# EAGLE design Interface_Board (EAGLE 9.0.1)
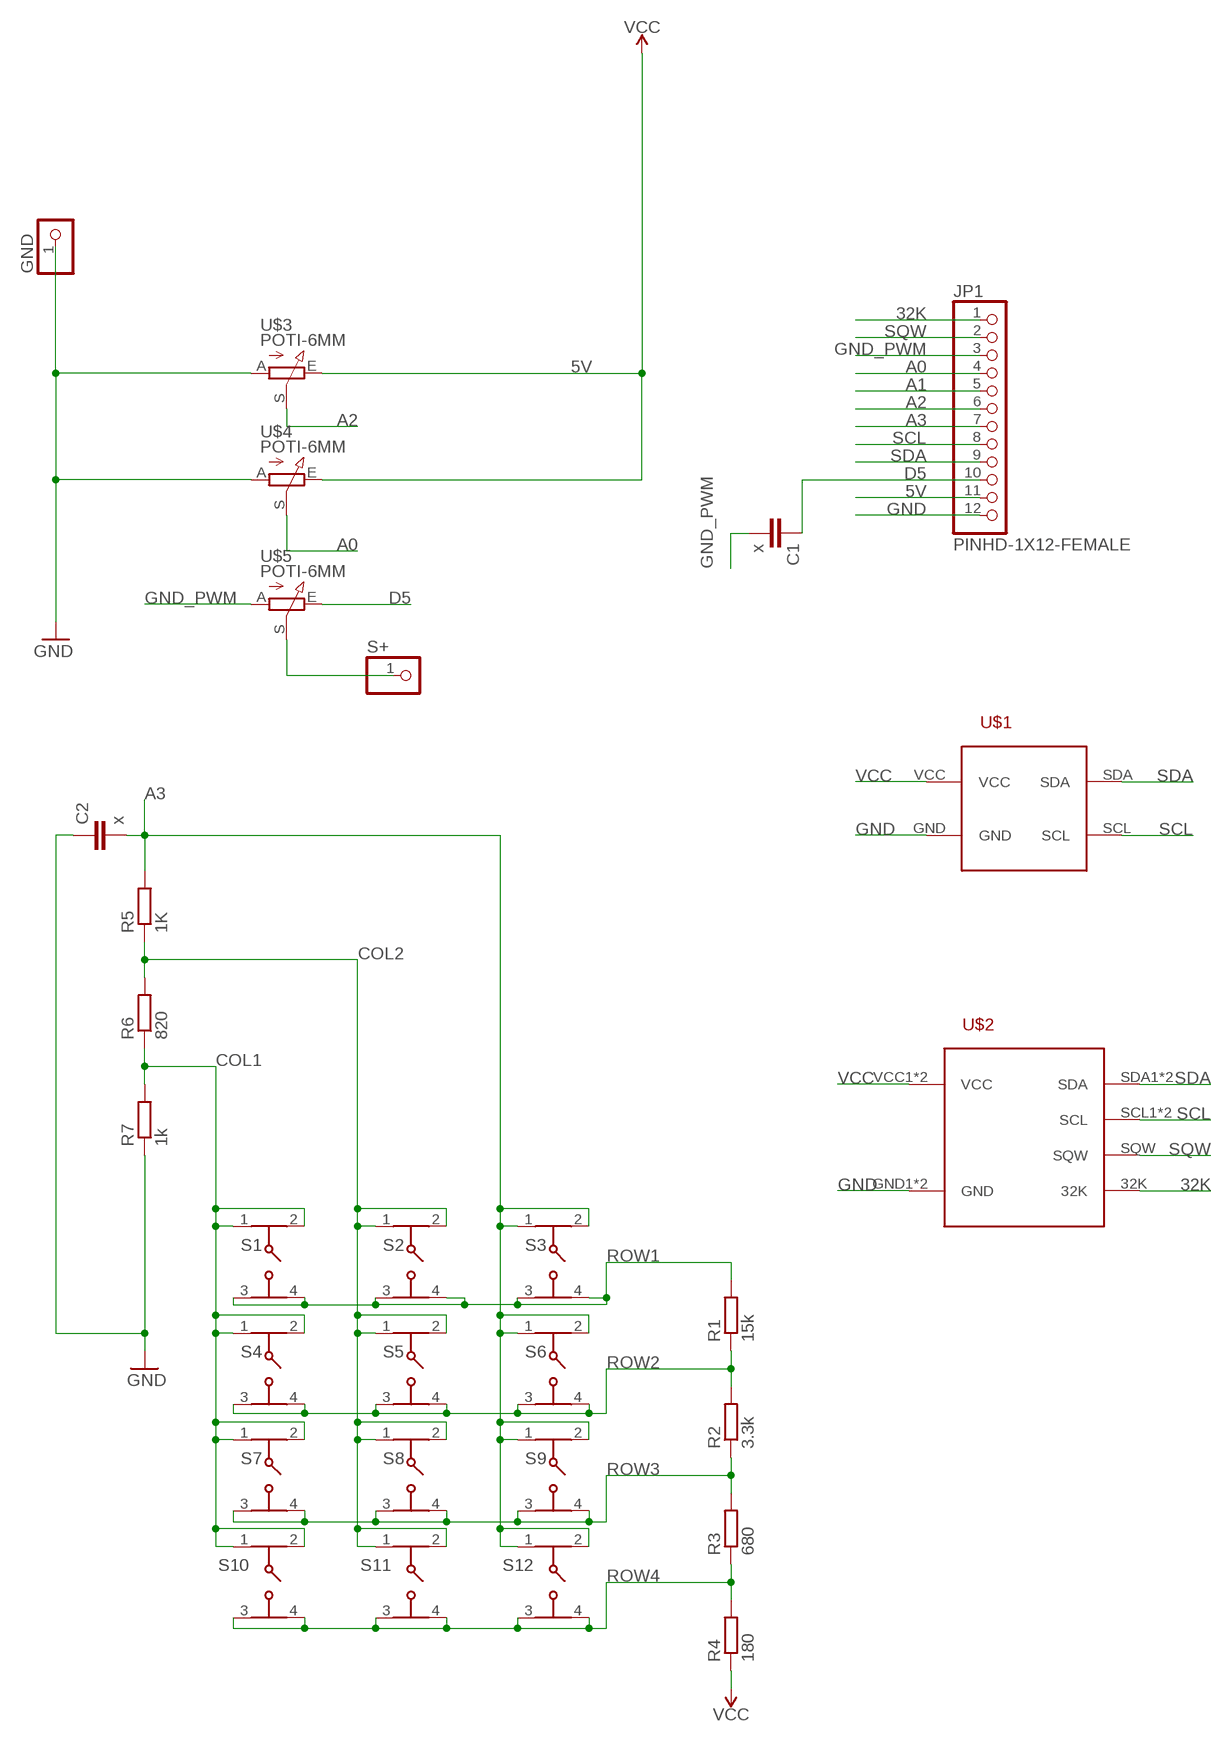
[diagram p0: schematic, sheet 1]

## Parts
C1  x  C-EU025-025X050  [C025-025X050]
C2  x  C-EU025-025X050  [C025-025X050]
GND  PINHD-1X1  [1X01]
JP1  PINHD-1X12-FEMALE  [1X12-FEMALE]
R1  15k  R-EU_R0603  [R0603]
R2  3.3k  R-EU_R0603  [R0603]
R3  680  R-EU_R0603  [R0603]
R4  180  R-EU_R0603  [R0603]
R5  1K  R-EU_R0603  [R0603]
R6  820  R-EU_R0603  [R0603]
R7  1k  R-EU_R0603  [R0603]
S1  TACTILE_BUTTON_6X6X9.5  [TACTILE_SWITCH_PTH_6.0MM]
S2  TACTILE_BUTTON_6X6X9.5  [TACTILE_SWITCH_PTH_6.0MM]
S3  TACTILE_BUTTON_6X6X9.5  [TACTILE_SWITCH_PTH_6.0MM]
S4  TACTILE_BUTTON_6X6X9.5  [TACTILE_SWITCH_PTH_6.0MM]
S5  TACTILE_BUTTON_6X6X9.5  [TACTILE_SWITCH_PTH_6.0MM]
S6  TACTILE_BUTTON_6X6X9.5  [TACTILE_SWITCH_PTH_6.0MM]
S7  TACTILE_BUTTON_6X6X9.5  [TACTILE_SWITCH_PTH_6.0MM]
S8  TACTILE_BUTTON_6X6X9.5  [TACTILE_SWITCH_PTH_6.0MM]
S9  TACTILE_BUTTON_6X6X9.5  [TACTILE_SWITCH_PTH_6.0MM]
S10  TACTILE_BUTTON_6X6X9.5  [TACTILE_SWITCH_PTH_6.0MM]
S11  TACTILE_BUTTON_6X6X9.5  [TACTILE_SWITCH_PTH_6.0MM]
S12  TACTILE_BUTTON_6X6X9.5  [TACTILE_SWITCH_PTH_6.0MM]
S+  PINHD-1X1  [1X01]
U$1  OLED_BREAKOUT  [OLED_128X32_BREAKOUT]
U$2  DS3231_BREAKOUT  [DS3231_BREAKOUT]
U$3  POTI-6MM  [POTI-6MM]
U$4  POTI-6MM  [POTI-6MM]
U$5  POTI-6MM  [POTI-6MM]

## Nets
5V: JP1.11 U$3.E U$4.E ; supply symbol labelled VCC
32K [Signal]: JP1.1 U$2.32K
A0 [Signal]: JP1.4 U$4.S
A1 [Signal]: JP1.5
A2 [Signal]: JP1.6 U$3.S
A3: C2.2 JP1.7 R5.2 S3.1 S3.2 S6.1 S6.2 S9.1 S9.2 S12.1 S12.2
COL1: R6.1 R7.2 S1.1 S1.2 S4.1 S4.2 S7.1 S7.2 S10.1 S10.2
COL2: R5.1 R6.2 S2.1 S2.2 S5.1 S5.2 S8.1 S8.2 S11.1 S11.2
D5: C1.1 JP1.10 U$5.E
GND: C2.1 GND.1 JP1.12 R7.1 U$1.GND U$2.GND1(GND) U$2.GND2(GND) U$3.A U$4.A
GND_PWM [Signal]: C1.2 JP1.3 U$5.A
ROW1: R1.2 S1.3 S1.4 S2.3 S2.4 S3.3 S3.4
ROW2: R1.1 R2.2 S4.3 S4.4 S5.3 S5.4 S6.3 S6.4
ROW3: R2.1 R3.2 S7.3 S7.4 S8.3 S8.4 S9.3 S9.4
ROW4: R3.1 R4.2 S10.3 S10.4 S11.3 S11.4 S12.3 S12.4
S+ [Signal]: S+.1 U$5.S
SCL [Signal]: JP1.8 U$1.SCL U$2.SCL1(SCL) U$2.SCL2(SCL)
SDA [Signal]: JP1.9 U$1.SDA U$2.SDA1(SDA) U$2.SDA2(SDA)
SQW [Signal]: JP1.2 U$2.SQW
VCC: R4.1 U$1.VCC U$2.VCC1(VCC) U$2.VCC2(VCC)

## Library data of the parts
C1 C2 = rcl:C-EU: CAPACITOR, European symbol; SPICEPREFIX: C
GND S+ = pinhead:PINHD-1X1: PIN HEADER
JP1 = Pat Sonstiges:PINHD-1X12
R1-R7 = rcl:R-EU_: RESISTOR, European symbol; SPICEPREFIX: R
S1-S12 = Pat Sonstiges:TACTILE_BUTTON_6X6X9.5
U$1 = My Breakout Boards:OLED_BREAKOUT
U$2 = My Breakout Boards:DS3231_BREAKOUT
U$3-U$5 = Pat Sonstiges:POTI-

## Net classes
0 GND/VCC: width 0.254 mm, drill 0.8 mm, clearance 0.254 mm
1 Signal: width 0.254 mm, drill 0.8 mm, clearance 0.254 mm to class 0, clearance 0.254 mm

## Board
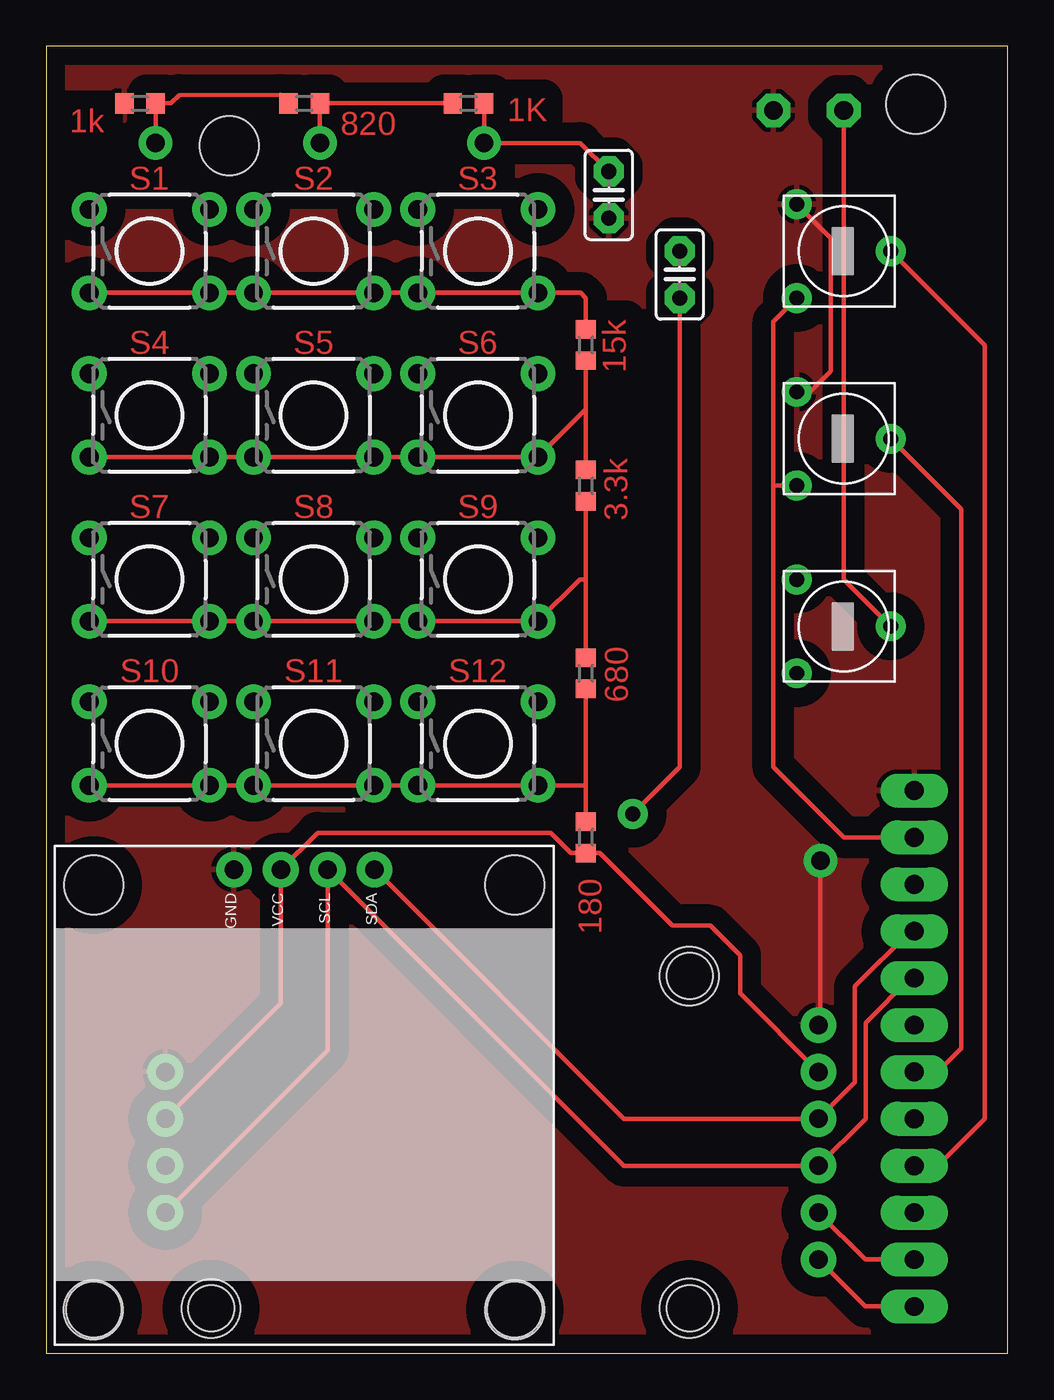
[diagram p1: board, top side]
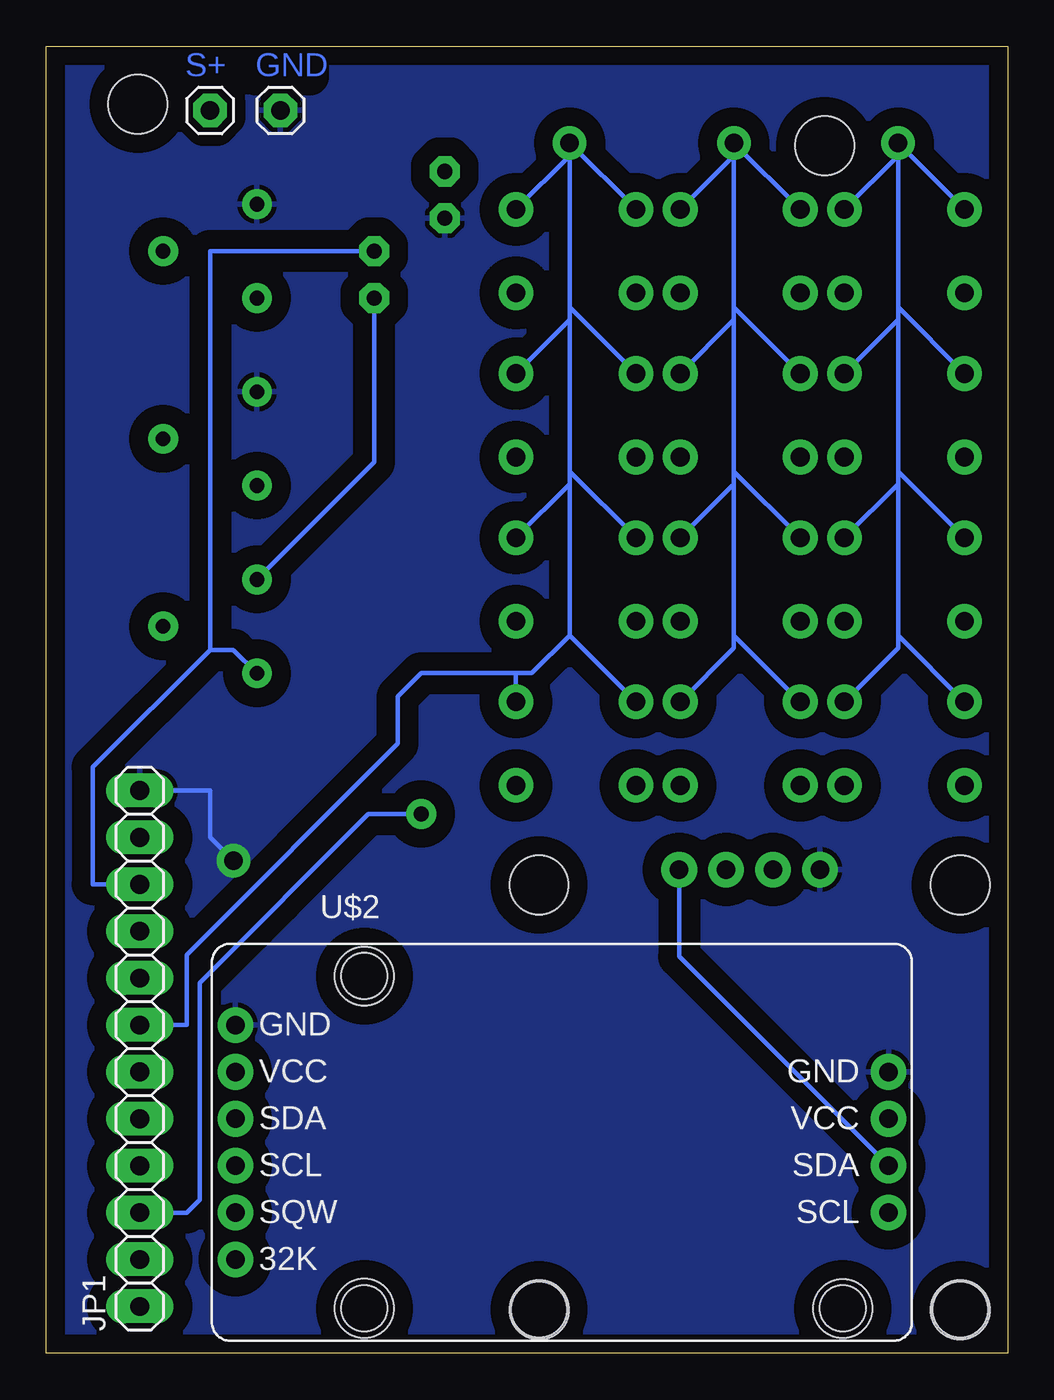
[diagram p2: board, bottom side, seen from below]

Size 52.05 x 70.79 mm. Coordinates in mm from the lower left corner, seen from the top.
Outline: 0,0 52.05,0 52.05,70.79 0,70.79 0,0
Copper layers (1*16): Top 0.035mm / dielectric 1.5mm / Bottom 0.035mm
Design rules "MakerSpace": minimum track width 8mil, minimum drill 0.6mm, track to track 8mil, track to pad 8mil, pad to pad 8mil, via to via 8mil, smd to smd 8mil, copper to edge 40mil, drill to drill 10mil, minimum pad ring 16mil, minimum via ring 16mil, stop-mask expansion 4mil, vias tented up to drill 0mil, thermal gap 10mil
Holes 3.2 mm at 9.91,65.41 47.08,67.64 2.57,25.36 25.37,25.37 34.82,20.43 34.82,2.43 25.36,2.37 8.92,2.43 2.56,2.36

### Footprints (pad centres in the part's own frame; a part is rotated, then mirrored left to right if it is on the bottom)
C025-025X050 = drill 0.813 octagon: 1 -1.27,0; 2 1.27,0
1X01 = drill 1.016 octagon: 1 0,0
1X12-FEMALE = drill 1.016 long: 1 -13.97,0; 2 -11.43,0; 3 -8.89,0; 4 -6.35,0; 5 -3.81,0; 6 -1.27,0; 7 1.27,0; 8 3.81,0; 9 6.35,0; 10 8.89,0; 11 11.43,0; 12 13.97,0
R0603 = smd 1 x 1.1: 1 -0.85,0; 2 0.85,0
TACTILE_SWITCH_PTH_6.0MM = drill 1.016 pad 1.88: 1 -3.251,2.261; 2 3.251,2.261; 3 -3.251,-2.261; 4 3.251,-2.261
OLED_128X32_BREAKOUT = drill 1 pad 1.93: GND 3.81,-12.23; SCL -1.27,-12.23; SDA -3.81,-12.23; VCC 1.27,-12.23 | hole 3.2: 11.4,-11.4; -11.4,-11.4 | hole 3: 11.4,11.6; -11.4,11.6
DS3231_BREAKOUT = drill 1 pad 1.93: 32K -17.68,-6.35; GND1 -17.68,6.35; GND2 17.68,3.81; SCL1 -17.68,-1.27; SCL2 17.68,-3.81; SDA1 -17.68,1.27; SDA2 17.68,-1.27; SQW -17.68,-3.81; VCC1 -17.68,3.81; VCC2 17.68,1.27 | hole 2.5: -10.7,9; -10.7,-9; 15.2,-9
POTI-6MM = drill 0.8: A -2.54,-2.54; E 2.54,-2.54; S 0,2.54

### Placement (x,y rotation side)
C1  34.29,58.42 270 top
C2  30.46,62.74 90 top
GND  39.37,67.31 0 bottom
JP1  46.99,16.51 90 bottom
R1  29.21,54.61 90 top
R2  29.21,46.99 90 top
R3  29.21,36.83 90 top
R4  29.21,27.94 90 top
R5  22.86,67.69 0 top
R6  13.97,67.69 0 top
R7  5.08,67.69 0 top
S1  5.59,59.69 0 top
S2  14.48,59.69 0 top
S3  23.37,59.69 0 top
S4  5.59,50.8 0 top
S5  14.48,50.8 0 top
S6  23.37,50.8 0 top
S7  5.59,41.91 0 top
S8  14.48,41.91 0 top
S9  23.37,41.91 0 top
S10  5.59,33.02 0 top
S11  14.48,33.02 0 top
S12  23.37,33.02 0 top
S+  43.18,67.31 0 bottom
U$1  13.97,13.97 180 top
U$2  24.13,11.43 0 bottom
U$3  43.18,49.53 270 top
U$4  43.18,59.69 270 top
U$5  43.18,39.37 270 top

### Tracks (layer width: path | path; a pad name or v marks a point on that pad's centre or on a via)
5V
  Top 0.254: JP1.11 43.18,27.94 39.37,31.75 39.37,36.83 39.37,46.99 | U$3.E 39.37,46.99 | 39.37,46.99 39.37,55.88 U$4.E
32K
  Top 0.254: U$2.32K 44.35,2.54 JP1.1
A0
  Top 0.254: U$4.S 50.8,54.61 50.8,12.7 48.26,10.16 JP1.4
A2
  Top 0.254: JP1.6 48.26,15.24 49.53,16.51 49.53,45.72 U$3.S
A3  (via drill 1)
  Top 0.254: R5.2 v23.71,65.54 28.92,65.54 C2.2
  Bottom 0.254: v23.71,65.54 23.71,56.65 | 23.71,55.97 23.71,47.76 | 23.71,47.08 23.71,38.87 | 23.71,38.87 25.75,36.83 26.67,36.83 | 26.67,36.83 31.75,36.83 33.02,35.56 33.02,33.02 44.45,21.59 44.45,17.78 JP1.7 | S3.1 v23.71,65.54 | S3.2 23.71,64.86 v23.71,65.54 | S6.1 23.71,56.65 | S6.2 23.71,55.97 | 23.71,55.97 23.71,56.65 | S9.1 23.71,47.76 | S9.2 23.71,47.08 | 23.71,47.08 23.71,47.76 | S12.2 26.62,36.78 26.67,36.83 | S12.1 23.71,38.87
COL1  (via drill 1)
  Top 0.254: v5.93,65.54 R7.2 6.73,67.69 7.19,68.14 12.66,68.16 R6.1
  Bottom 0.254: v5.93,65.54 5.93,56.65 | 5.93,55.97 5.93,47.76 | 5.93,47.76 5.93,47.08 | 5.93,47.08 5.93,38.87 | S4.1 5.93,56.65 | S4.2 5.93,55.97 | 5.93,55.97 5.93,56.65 | S7.2 5.93,47.08 | S7.1 5.93,47.76 | S10.1 5.93,38.87 | S10.2 5.93,38.19 5.93,38.87 | S1.2 5.93,64.86 v5.93,65.54 | S1.1 v5.93,65.54
COL2  (via drill 1)
  Top 0.254: v14.82,65.54 R6.2 R5.1
  Bottom 0.254: v14.82,65.54 14.82,56.65 | 14.82,55.97 14.82,47.76 | 14.82,47.76 14.82,46.99 | 14.82,46.99 14.82,38.87 | S11.1 14.82,38.87 | S11.2 14.82,38.19 14.82,38.87 | S8.2 14.91,46.99 14.82,46.99 | S8.1 14.82,47.76 | S5.1 14.82,56.65 | S5.2 14.82,55.97 | 14.82,55.97 14.82,56.65 | S2.1 v14.82,65.54 | S2.2 14.82,64.86 v14.82,65.54
D5
  Bottom 0.254: 43.18,38.1 43.18,59.69 C1.1 | 43.18,38.1 49.53,31.75 49.53,25.4 JP1.10 | U$5.E 41.91,38.1 43.18,38.1
GND  (via drill 1)
  Top 0.254: U$2.GND1 41.91,17.88 v41.91,26.67 | U$4.A 42.48,60.39 42.48,53.19 41.35,52.07 U$3.A
  Bottom 0.254: v41.91,26.67 43.18,27.94 43.18,30.48 JP1.12
  pour Top (isolate 1.016): 0,0 52.07,0 52.07,71.12 0,71.12
  pour Bottom (isolate 1.016): 0,0 52.07,0 52.07,71.12 0,71.12
GND_PWM  (via drill 0.8)
  Top 0.254: v31.75,29.21 34.29,31.75 C1.2
  Bottom 0.254: v31.75,29.21 34.6,29.21 43.75,20.07 43.75,8.32 44.45,7.62 JP1.3 | U$5.A 34.29,48.26 C1.2
ROW1
  Top 0.254: S1.3 S1.4 S2.3 S2.4 S3.3 S3.4 28.93,57.43 29.21,57.15 R1.2
ROW2
  Top 0.254: S4.3 S4.4 S5.3 S5.4 S6.3 S6.4 29.21,51.13 | 29.21,51.13 R1.1 | R2.2 29.21,51.13
ROW3
  Top 0.254: R3.2 29.21,41.91 | 29.21,41.91 R2.1 | 29.21,41.91 28.88,41.91 S9.4 S9.3 S8.4 S8.3 S7.4 S7.3
ROW4
  Top 0.254: R3.1 29.21,30.79 | 29.21,30.79 R4.2 | S12.4 26.95,30.76 | S10.3 S10.4 S11.3 S11.4 S12.3 S12.4 | S12.4 29.18,30.76 29.21,30.79
S+
  Top 0.254: U$5.S 43.18,41.91 S+.1
SCL
  Top 0.254: U$2.SCL2 15.24,16.41 U$1.SCL 31.28,10.16 U$2.SCL1 44.36,12.71 44.36,17.89 46.78,20.32 JP1.8
SDA
  Top 0.254: U$1.SDA 31.28,12.7 U$2.SDA1 43.78,14.68 43.78,19.86 46.78,22.86 JP1.9
  Bottom 0.254: U$1.SDA 17.78,21.49 U$2.SDA2
SQW
  Top 0.254: U$2.SQW 44.35,5.08 JP1.2
VCC
  Top 0.254: U$2.VCC2 12.7,18.95 U$1.VCC 14.69,28.19 27.3,28.19 28.41,27.09 R4.1 29.96,27.09 33.88,23.17 35.96,23.17 37.57,21.56 37.57,19.48 U$2.VCC1